# Altium schematic sheet Power_Supply.SchDoc
size A4
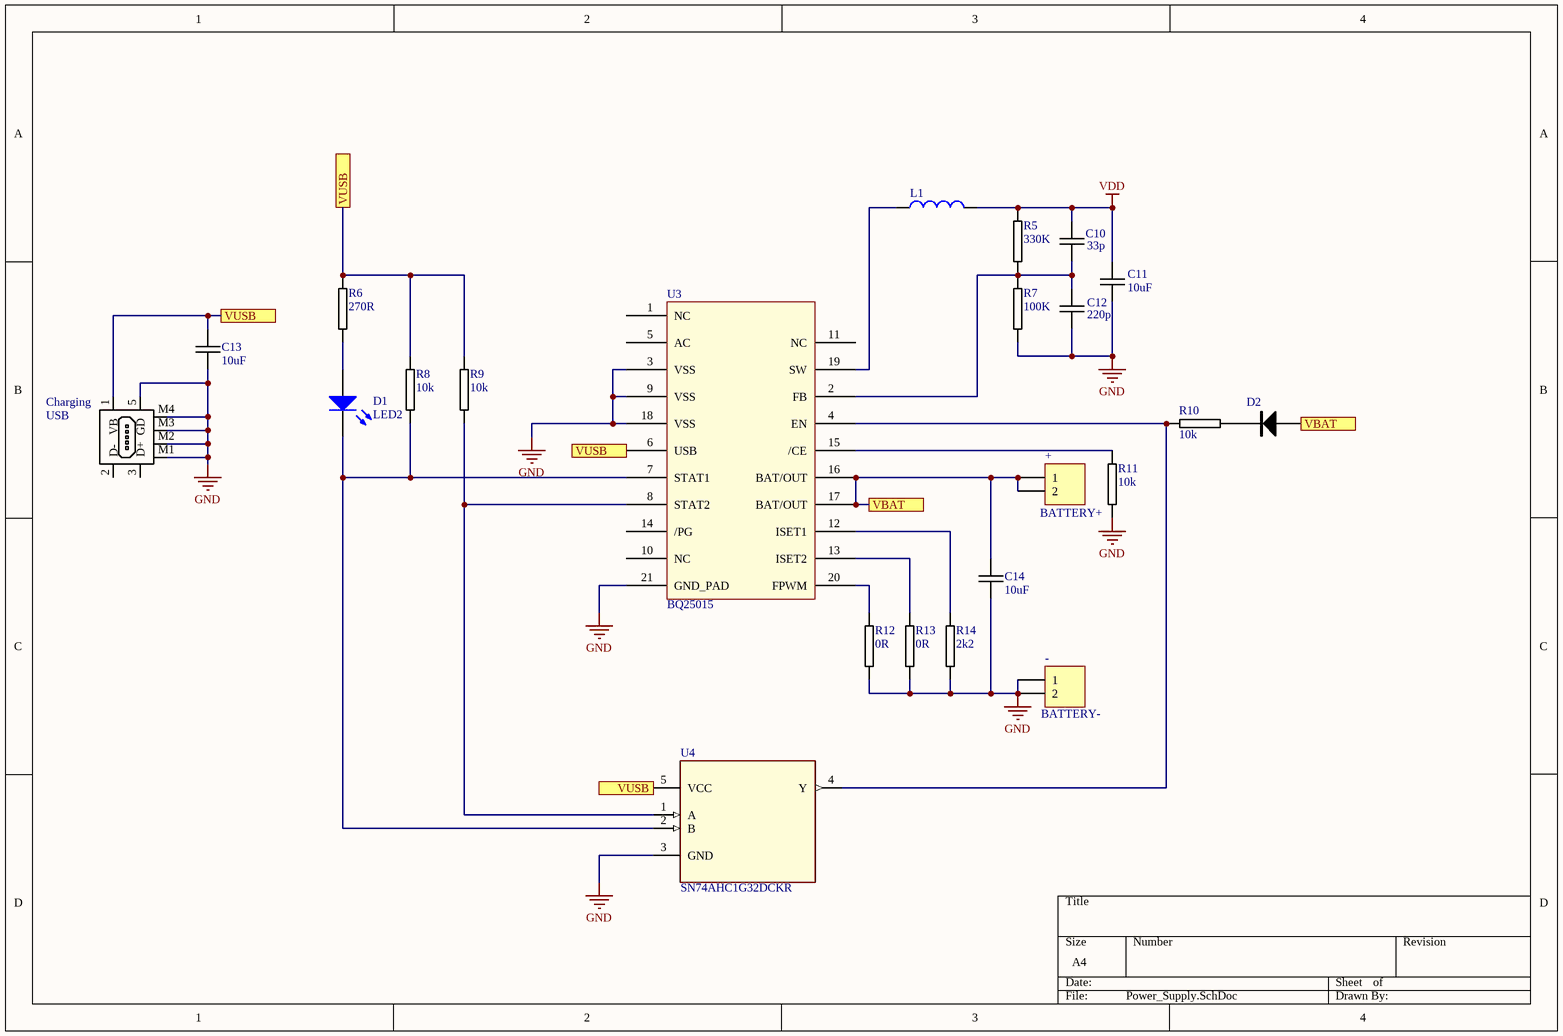
[diagram p0: Power_Supply.SchDoc]

## Parts
+  BATTERY+  [HDR1X2]
-  BATTERY-  [HDR1X2]
C10  33p  [0402C-TBD]
C11  10uF  [0603C-GENERIC]
C12  220p  [0402C-TBD]
C13  10uF  [0603C-GENERIC]
C14  10uF  [0603C-GENERIC]
Charging  USB  [USB-MINI-B-51387-0571]
D1  LED2  [0402C-GENERIC]
D2  DIODE-GENERIC  [0603C-GENERIC]  (value not drawn)
L1  Inductor  [1210C-GENERIC]  (value not drawn)
R5  330K  [0402R-GENERIC]
R6  270R  [0402R-GENERIC]
R7  100K  [0402R-GENERIC]
R8  10k  [0402R-GENERIC]
R9  10k  [0402R-GENERIC]
R10  10k  [0402R-GENERIC]
R11  10k  [0402R-GENERIC]
R12  0R  [0402R-GENERIC]
R13  0R  [0402R-GENERIC]
R14  2k2  [0402R-GENERIC]
U3  BQ25015  [*CONV_BQ25015RHLT_BQ25015RHLT(Primary)]
U4  SN74AHC1G32DCKR  [*SOT65P210X110-5N]

## Ports
VBAT, VUSB

## Nets
GND: -.1 -.2 C11.2 C12.2 C13.2 C14.2 Charging.5(GD) Charging.M1 Charging.M2 Charging.M3 Charging.M4 R7.2 R11.2 R12.2 R13.2 R14.2 U3.3(VSS) U3.9(VSS) U3.18(VSS) U3.21(GND_PAD) U4.3(GND)
VDD: C10.1 C11.1 L1.2 R5.1
VBAT: +.1 +.2 C14.1 D2.A U3.16(BAT/OUT) U3.17(BAT/OUT) ; port VBAT
VUSB: C13.1 Charging.1(VB) R6.1 R8.1 R9.1 U3.6(USB) U4.5(VCC) ; port VUSB
NetC10_2: C10.2 C12.1 R5.2 R7.1 U3.2(FB)
NetD1_1: D1.1(A) R6.2
NetD1_2: D1.2(K) R8.2 U3.7(STAT1) U4.2(B)
NetD2_K: D2.K R10.2
NetL1_1: L1.1 U3.19(SW)
NetR9_2: R9.2 U3.8(STAT2) U4.1(A)
NetR10_1: R10.1 U3.4(EN) U4.4(Y)
NetR11_1: R11.1 U3.15(/CE)
NetR12_1: R12.1 U3.20(FPWM)
NetR13_1: R13.1 U3.13(ISET2)
NetR14_1: R14.1 U3.12(ISET1)

Not connected (* = marked no-connect by the designer): Charging 2(D-) 3(D+); U3 1(NC) 5(AC) 10(NC) 11(NC) 14(/PG)

## Library data of the parts
+ - = Header 2: Header, 2-Pin; LatestRevisionDate: 17-Jul-2002; LatestRevisionNote: Re-released for DXP Platform.; Publisher: Altium Limited
C10 C12 = 0402C-TBD: CAPACITOR 0402 CERAMIC
C11 C13 C14 = 0603C-10UF-10V-X5R-TDK: CAPACITOR 0603 CERAMIC; Manufacturer Part Number: C1608X5R0J106M; Manufacturer: TDK Corporation; Reel: C31; Supplier 1: Digi-Key; Supplier Part Number 1: 445-4112-2-ND
Charging = USB-MINI-B-MOLEX-51387-0571: MINI USB B DEVICE CONNECTOR MOLEX 51387-0571; Supplier 1: Digi-Key; Supplier Part Number 1: WM5462DKR-ND
D1 = LED2: Typical RED, GREEN, YELLOW, AMBER GaAs LED; Published: 8-Jun-2000; LatestRevisionDate: 17-Jul-2002; LatestRevisionNote: Re-released for DXP Platform.; PackageVersion: Feb-2002; PackageReference: 3.2X1.6X1.1; Publisher: Altium Limited; PackageDescription: SM LED; 2 Flat Leads
D2 = DIODE-GENERIC: GENERIC DIODE; pin to pad: A>1 K>2
L1 = Inductor: Code_IEC: 1005; Value: 6n8; Published: 8-Jun-2000; LatestRevisionDate: 29-May-2009; LatestRevisionNote: IPC-7351 Footprint Added.; PackageReference: 0402-A; Publisher: Altium Limited; PackageDescription: Chip Inductor; Code_JEITA: 0402
R5-R14 = 0402R-GENERIC: RESISTOR 0402 GENERIC
U3 = BQ25015: SINGLE-CHIPCHARGERANDDC/DCCONVERTERICFORPORTABLEAPPLICATIONS
U4 = SN74AHC1G32DCKR: Single 2-Input Positive-OR Gate 5-SC70 -40 to 125; MF: Texas Instruments; Digi-Key_Part_Number: 296-8749-1-ND; Digi-Key_Purchase_URL: https://www.digikey.com/product-detail/en/texas-instruments/SN74AHC1G32DCKR/296-8749-1-ND/373812?utm_source=snapeda&utm_medium=aggregator&utm_campaign=symbol; Package: SC-70-5 Texas Instruments; MP: SN74AHC1G32DCKR; SnapEDA_Link: https://www.snapeda.com/parts/SN74AHC1G32DCKR/Texas%20Instruments/view-part/429264/?ref=snap; Value: *